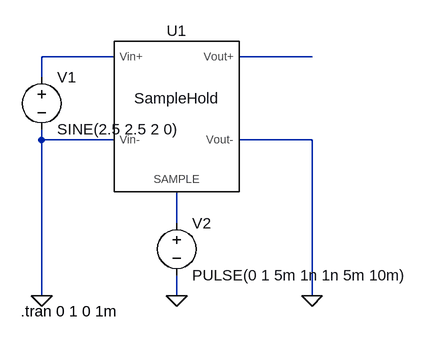
[diagram p0: schematic sample-hold.test.asc]
sample-hold.test.asc, the LTspice schematic file:
Version 4
SHEET 1 1560 680
WIRE 192 208 80 208
WIRE 496 208 384 208
WIRE 80 240 80 208
WIRE 80 336 80 320
WIRE 192 336 80 336
WIRE 496 336 384 336
WIRE 288 464 288 416
WIRE 80 576 80 336
WIRE 288 576 288 544
WIRE 496 576 496 336
FLAG 80 576 0
FLAG 496 576 0
FLAG 288 576 0
SYMBOL sample-hold 288 288 R0
SYMATTR InstName U1
SYMBOL voltage 80 224 R0
WINDOW 123 0 0 Left 2
WINDOW 39 0 0 Left 2
SYMATTR InstName V1
SYMATTR Value SINE(2.5 2.5 2 0)
SYMBOL voltage 288 448 R0
WINDOW 123 0 0 Left 2
WINDOW 39 0 0 Left 2
SYMATTR InstName V2
SYMATTR Value PULSE(0 1 5m 1n 1n 5m 10m)
TEXT 48 600 Left 2 !.tran 0 1 0 1m

The netlist it stands for:
* sample-hold.test.asc
XU1 N003 N001 0 N002 0 SampleHold  ; pins SAMPLE Vin+ Vin- Vout+ Vout-
V1 N001 0 SINE(2.5 2.5 2 0)
V2 N003 0 PULSE(0 1 5m 1n 1n 5m 10m)
.tran 0 1 0 1m
.lib sample-hold.sub
.backanno
.end